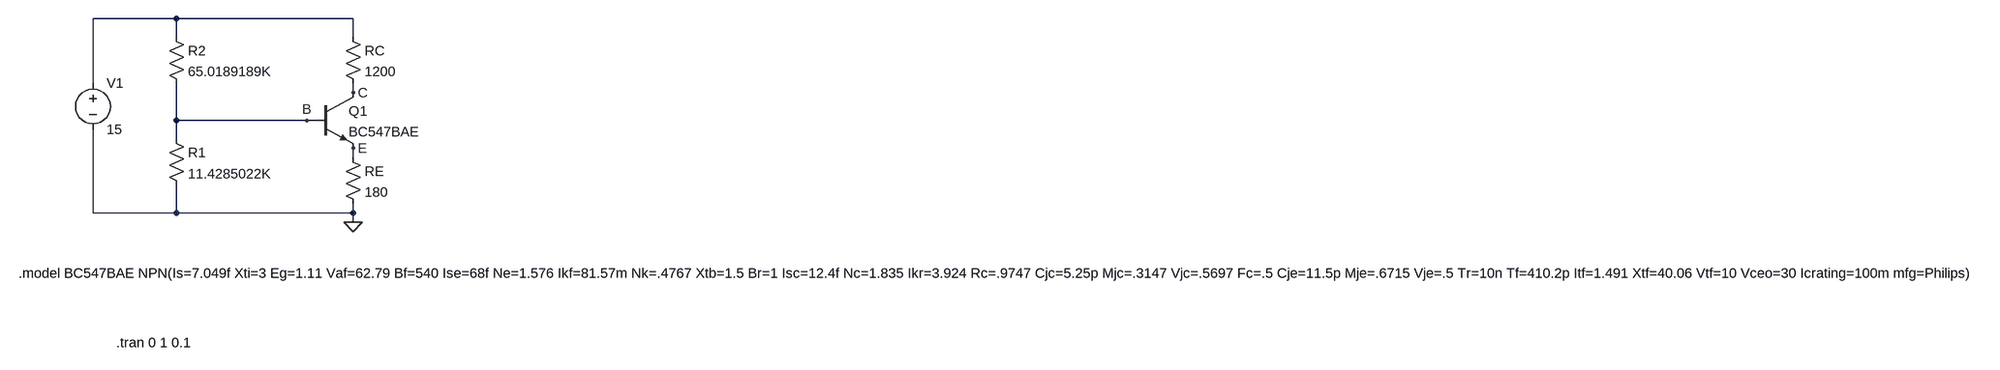
[diagram p0: schematic Sim_Ideal.asc]
Sim_Ideal.asc, the LTspice schematic file:
Version 4.1
SHEET 1 5476 680
WIRE -48 -32 -192 -32
WIRE 256 -32 -48 -32
WIRE -48 0 -48 -32
WIRE 256 0 256 -32
WIRE -192 80 -192 -32
WIRE 256 96 256 80
WIRE -48 144 -48 80
WIRE 176 144 -48 144
WIRE 192 144 176 144
WIRE -48 176 -48 144
WIRE 256 208 256 192
WIRE -192 304 -192 160
WIRE -48 304 -48 256
WIRE -48 304 -192 304
WIRE 256 304 256 288
WIRE 256 304 -48 304
WIRE 256 320 256 304
FLAG 256 320 0
FLAG 256 96 C
FLAG 256 192 E
FLAG 176 144 B
SYMBOL npn 192 96 R0
SYMATTR InstName Q1
SYMATTR Value BC547BAE
SYMBOL res -64 -16 R0
SYMATTR InstName R2
SYMATTR Value 65.0189189K
SYMBOL res 240 -16 R0
SYMATTR InstName RC
SYMATTR Value 1200
SYMBOL res 240 192 R0
SYMATTR InstName RE
SYMATTR Value 180
SYMBOL res -64 160 R0
SYMATTR InstName R1
SYMATTR Value 11.4285022K
SYMBOL voltage -192 64 R0
SYMATTR InstName V1
SYMATTR Value 15
TEXT -320 408 Left 2 !.model BC547BAE NPN(Is=7.049f Xti=3 Eg=1.11 Vaf=62.79 Bf=540 Ise=68f Ne=1.576 Ikf=81.57m Nk=.4767 Xtb=1.5 Br=1 Isc=12.4f Nc=1.835 Ikr=3.924 Rc=.9747 Cjc=5.25p Mjc=.3147 Vjc=.5697 Fc=.5 Cje=11.5p Mje=.6715 Vje=.5 Tr=10n Tf=410.2p Itf=1.491 Xtf=40.06 Vtf=10 Vceo=30 Icrating=100m mfg=Philips)
TEXT -152 528 Left 2 !.tran 0 1 0.1

The netlist it stands for:
* Sim_Ideal.asc
Q1 C B E 0 BC547BAE
R2 N001 B 65.0189189K
RC N001 C 1200
RE E 0 180
R1 B 0 11.4285022K
V1 N001 0 15
.model NPN NPN
.model PNP PNP
.lib standard.bjt
.model BC547BAE NPN(Is=7.049f Xti=3 Eg=1.11 Vaf=62.79 Bf=540 Ise=68f Ne=1.576 Ikf=81.57m Nk=.4767 Xtb=1.5 Br=1 Isc=12.4f Nc=1.835 Ikr=3.924 Rc=.9747 Cjc=5.25p Mjc=.3147 Vjc=.5697 Fc=.5 Cje=11.5p Mje=.6715 Vje=.5 Tr=10n Tf=410.2p Itf=1.491 Xtf=40.06 Vtf=10 Vceo=30 Icrating=100m mfg=Philips)
.tran 0 1 0.1
.backanno
.end